# EAGLE design LipSync4_UI_Board_Alpha2 (EAGLE 9.6.2)
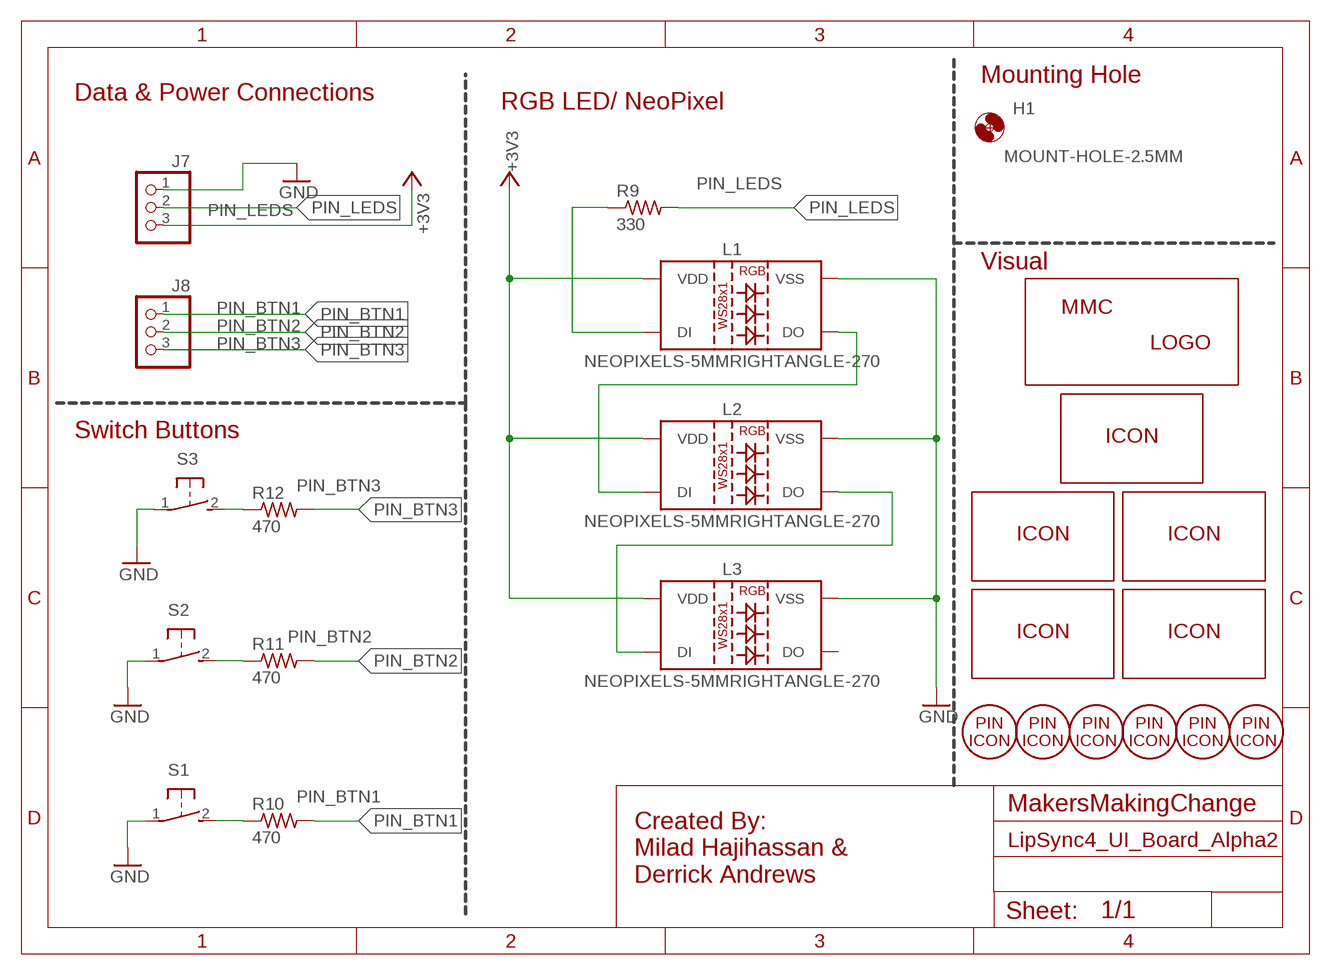
[diagram p0: schematic, sheet 1]

## Parts
H1  MOUNT-HOLE-2.5MM  [HOLE-2.5MM]
J7  HEADER_FEMALE-1X3-LONGER  [HEADER_FEMALE-1X03_LONGER]
J8  HEADER_FEMALE-1X3-LONGER  [HEADER_FEMALE-1X03_LONGER]
L1  NEOPIXELS-5MMRIGHTANGLE-270  [NEOPIXELS-RIGHTANGLE-270-5MM]
L2  NEOPIXELS-5MMRIGHTANGLE-270  [NEOPIXELS-RIGHTANGLE-270-5MM]
L3  NEOPIXELS-5MMRIGHTANGLE-270  [NEOPIXELS-RIGHTANGLE-270-5MM]
LABE_UI-BOARD-BOTTOM  MMC_ICON-UI-BOARD  [ICON_UI-BOARD]
LABEL_ALPHA2-BOTTOM  MMC_ICON-ALPHA2  [ICON_ALPHA2]
LABEL_BUTTON  MMC_ICON-BUTTON  [ICON_BUTTON]
LABEL_ICON_PIN1  MMC_PIN-ICON-PIN1  [PIN-ICON_1]
LABEL_ICON_PIN2  MMC_PIN-ICON-PIN2  [PIN-ICON_2]
LABEL_ICON_PIN3  MMC_PIN-ICON-PIN3  [PIN-ICON_3]
LABEL_ICON_PIN-DATA  MMC_PIN-ICON-DATA  [PIN-ICON_DATA]
LABEL_ICON_PIN-GND  MMC_PIN-ICON-GND  [PIN-ICON_GND]
LABEL_ICON_PIN-VCC  MMC_PIN-ICON-VCC  [PIN-ICON_VCC]
LABEL_LED  MMC_ICON-LED  [ICON_LED]
LABEL_LIPSYNC-BOTTOM  MMC_ICON-LIPSYNC4  [ICON_LIPSYNC4]
LABEL_MMC-LOGO  MMC_LOGO-SM  [MMC_SMALL_LOGO]
R9  330  RESISTOR-US-0204/5  [RESISTOR_0204/5]
R10  470  RESISTOR-US-0204/5  [RESISTOR_0204/5]
R11  470  RESISTOR-US-0204/5  [RESISTOR_0204/5]
R12  470  RESISTOR-US-0204/5  [RESISTOR_0204/5]
S1  SWITCH_OMRON_RA-RA  [B3F-31XX]
S2  SWITCH_OMRON_RA-RA  [B3F-31XX]
S3  SWITCH_OMRON_RA-RA  [B3F-31XX]

## Nets
+3V3: J7.3 L1.P2(VDD) L2.P2(VDD) L3.P2(VDD)
GND: J7.1 L1.P3(VSS) L2.P3(VSS) L3.P3(VSS) S1.1 S2.1 S3.1
N$1: R11.1 S2.2
N$2: L1.P1(DI) R9.1
N$3: R10.1 S1.2
N$4: L1.P4(DO) L2.P1(DI)
N$5: R12.1 S3.2
N$10: L2.P4(DO) L3.P1(DI)
PIN_BTN1: J8.1 R10.2
PIN_BTN2: J8.2 R11.2
PIN_BTN3: J8.3 R12.2
PIN_LEDS: J7.2 R9.2
Unconnected: L3.P4(DO)

## Notes on the sheet
- Mounting Hole
- Data & Power Connections
- RGB LED/ NeoPixel
- Visual
- Switch Buttons
- MakersMakingChange
- Created By: 
  Milad Hajihassan & 
  Derrick Andrews

## Library data of the parts
H1 = MMC Eagle:MOUNT-HOLE-: MOUNTING HOLE with drill center marker
J7 J8 = MMC Eagle:HEADER_FEMALE-1X3-LONGER: PIN HEADER
L1-L3 = MMC Eagle:NEOPIXELS-5MM: NeoPixel Diffused 5mm Through-Hole LED Addressable Lighting series 5 LED Discrete Serial (Shift Register) Red, Green, Blue (RGB) 5.00mm Dia. Options: Digikey - 1568-1213-ND <https://www.digikey.ca/en/products/detail/sparkfun-electronics/COM-12986/5673799> Mouser - 474-COM-12986 <https://www.mouser.ca/ProductDetail/SparkFun/COM-12986?qs=%2Fha2pyFadujF6KKYCR11tN6uoNPGeiRJUEZeJp5GtyQ%3D>
LABE_UI-BOARD-BOTTOM LABEL_ALPHA2-BOTTOM LABEL_BUTTON LABEL_LED LABEL_LIPSYNC-BOTTOM = MMC Eagle:MMC_ICON-
LABEL_ICON_PIN1-LABEL_ICON_PIN3 LABEL_ICON_PIN-DATA LABEL_ICON_PIN-GND LABEL_ICON_PIN-VCC = MMC Eagle:MMC_PIN-ICON-
LABEL_MMC-LOGO = MMC Eagle:MMC_LOGO-
R9-R12 = MMC Eagle:RESISTOR-US-: RESISTOR, American symbol
S1-S3 = MMC Eagle:SWITCH_OMRON_RA: OMRON SWITCH Now with beefier pads!

## Board
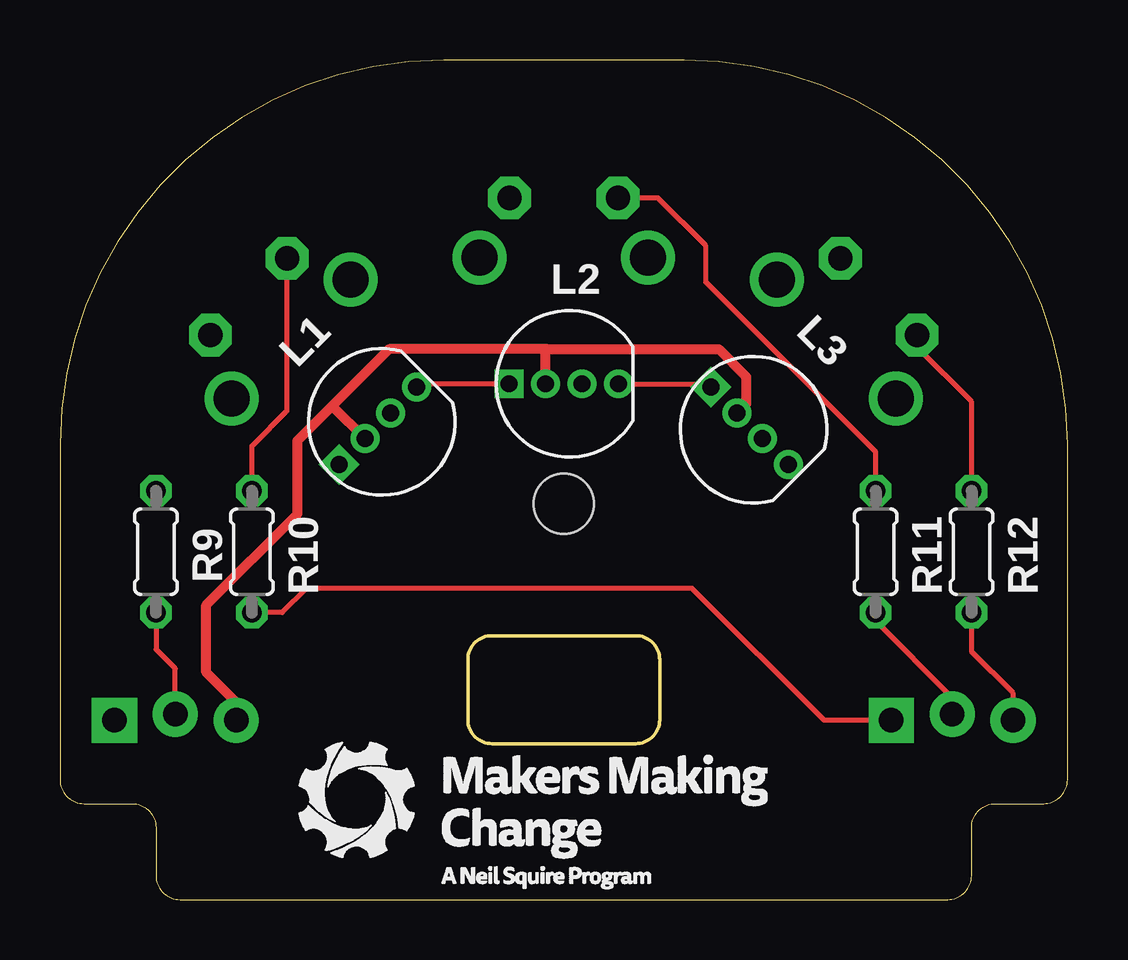
[diagram p1: board, top side]
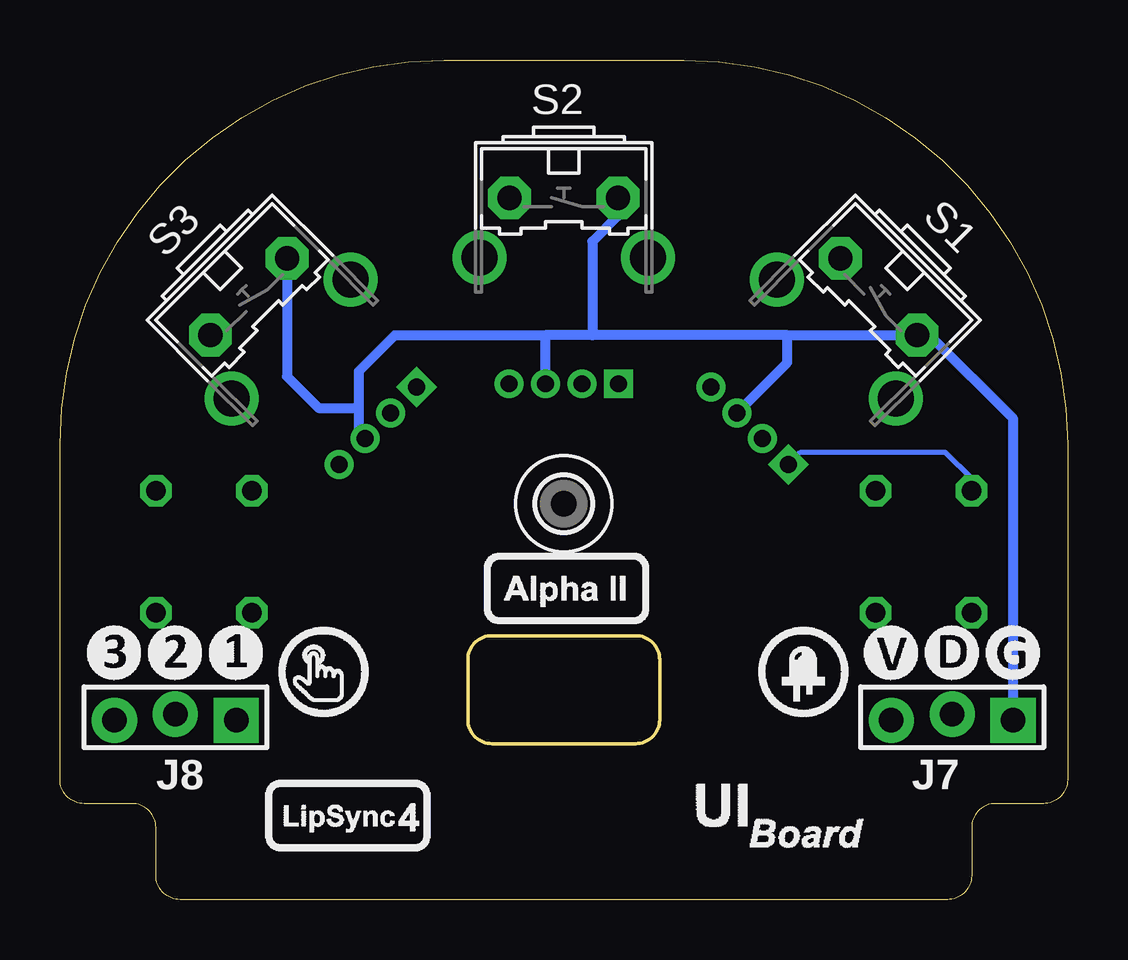
[diagram p2: board, bottom side, seen from below]

Size 42 x 35 mm. Coordinates in mm from the lower left corner, seen from the top.
Outline: 5,0 37,0 arc90 38,1 38,3 arc-90 39,4 41,4 arc90 42,5 42,19 arc90 26,35 16,35 arc90 0,19 0,5 arc90 1,4 3,4 arc-90 4,3 4,1 arc90 5,0
Outline: 24,11 18,11 arc90 17,10 17,7.5 arc90 18,6.5 24,6.5 arc90 25,7.5 25,10 arc90 24,11
Copper layers (1*16): Top 0.035mm / dielectric 1.5mm / Bottom 0.035mm
Design rules "default": minimum track width 6mil, minimum drill 0.35mm, track to track 6mil, track to pad 6mil, pad to pad 6mil, via to via 6mil, smd to smd 6mil, copper to edge 40mil, drill to drill 6mil, minimum pad ring 10mil, minimum via ring 8mil, stop-mask expansion 4mil, vias tented up to drill 0mil, thermal gap 10mil

### Footprints (pad centres in the part's own frame; a part is rotated, then mirrored left to right if it is on the bottom)
HOLE-2.5MM = hole 2.5: 0,0
HEADER_FEMALE-1X03_LONGER = drill 1.016 pad 1.88 square: 1 0,0.127 | drill 1.016 pad 1.88: 2 2.54,-0.127; 3 5.08,0.127
NEOPIXELS-RIGHTANGLE-270-5MM = drill 0.7 pad 1.016 square: P1 2.28,0 | drill 0.7 pad 1.016: P2 0.76,0; P3 -0.76,0; P4 -2.28,0
RESISTOR_0204/5 = drill 0.813 octagon: 1 -2.54,0; 2 2.54,0
B3F-31XX = drill 1.016 pad 1.778 octagon: 1 -2.261,-1.245; 2 2.261,-1.245 | drill 1.499 pad 2.032: 3 -3.505,1.245; 4 3.505,1.245

### Placement (x,y rotation side)
H1  21,16.5 0 bottom
J7  2.27,7.6 180 bottom
J8  34.65,7.6 180 bottom
L1  13.25,19.75 225 top
L2  21,21.5 180 top
L3  28.75,19.75 135 top
LABE_UI-BOARD-BOTTOM  12,3.5 0 bottom
LABEL_ALPHA2-BOTTOM  20.88,12.97 0 bottom
LABEL_BUTTON  31,9.5 0 bottom
LABEL_ICON_PIN1  34.65,10.3 0 bottom
LABEL_ICON_PIN2  37.19,10.3 0 bottom
LABEL_ICON_PIN3  39.73,10.3 0 bottom
LABEL_ICON_PIN-DATA  4.81,10.3 0 bottom
LABEL_ICON_PIN-GND  2.27,10.3 0 bottom
LABEL_ICON_PIN-VCC  7.35,10.3 0 bottom
LABEL_LED  11,9.5 0 bottom
LABEL_LIPSYNC-BOTTOM  30,3.5 0 bottom
LABEL_MMC-LOGO  21,3.5 0 top
R9  4,14.5 270 top
R10  8,14.5 270 top
R11  34,14.5 270 top
R12  38,14.5 270 top
S1  8.75,24.25 135 bottom
S2  21,28 180 bottom
S3  33.25,24.25 225 bottom

### Tracks (layer width: path | path; a pad name or v marks a point on that pad's centre or on a via)
+3V3
  Top 0.406: 11.39,20.61 9.91,19.13 9.91,16.08 6.1,12.27 6.1,9.48 7.35,8.22 J7.3 | 20.32,22.94 13.72,22.94 11.39,20.61 | L2.P2 20.24,22.86 20.32,22.94 | L1.P2 11.39,20.54 11.39,20.61 | L3.P2 28.6,20.68 28.6,21.8 27.46,22.94 20.32,22.94
GND
  Bottom 0.406: 11.68,23.53 S1.1 5.75,23.53 2.27,20.05 J7.1 | 11.68,23.53 19.81,23.53 | 19.81,23.53 21.76,23.53 | L2.P3 21.76,23.53 | S2.1 18.74,28.5 19.81,27.43 19.81,23.53 | 21.76,23.53 28.03,23.53 29.54,22.02 29.54,20.5 | L1.P3 11.68,22.39 11.68,23.53 | L3.P3 29.54,19.46 29.54,20.5 | 29.54,20.5 31.22,20.5 32.53,21.81 S3.1
N$1
  Top 0.2: R11.1 34,18.66 26.92,25.73 26.92,27.26 24.94,29.25 S2.2
N$2
  Bottom 0.2: R9.1 4,17.54 5.11,18.65 11.13,18.65 L1.P1
N$3
  Top 0.2: R10.1 8,18.91 9.47,20.38 S1.2
N$4
  Top 0.2: L2.P1 15,21.5 L1.P4
N$5
  Top 0.2: R12.1 38,20.75 35.73,23.02 S3.2
N$10
  Top 0.2: L2.P4 27,21.5 L3.P1
PIN_BTN1
  Top 0.2: J8.1 31.86,7.47 26.35,12.98 10.29,12.98 9.27,11.96 R10.2
PIN_BTN2
  Top 0.2: J8.2 37.19,8.42 34,11.61 R11.2
PIN_BTN3
  Top 0.2: J8.3 39.73,8.61 37.99,10.35 38,10.35 R12.2
PIN_LEDS
  Top 0.2: R9.2 4,10.44 4.81,9.63 J7.2